# EAGLE design audio-visualizer (EAGLE 9.6.2)
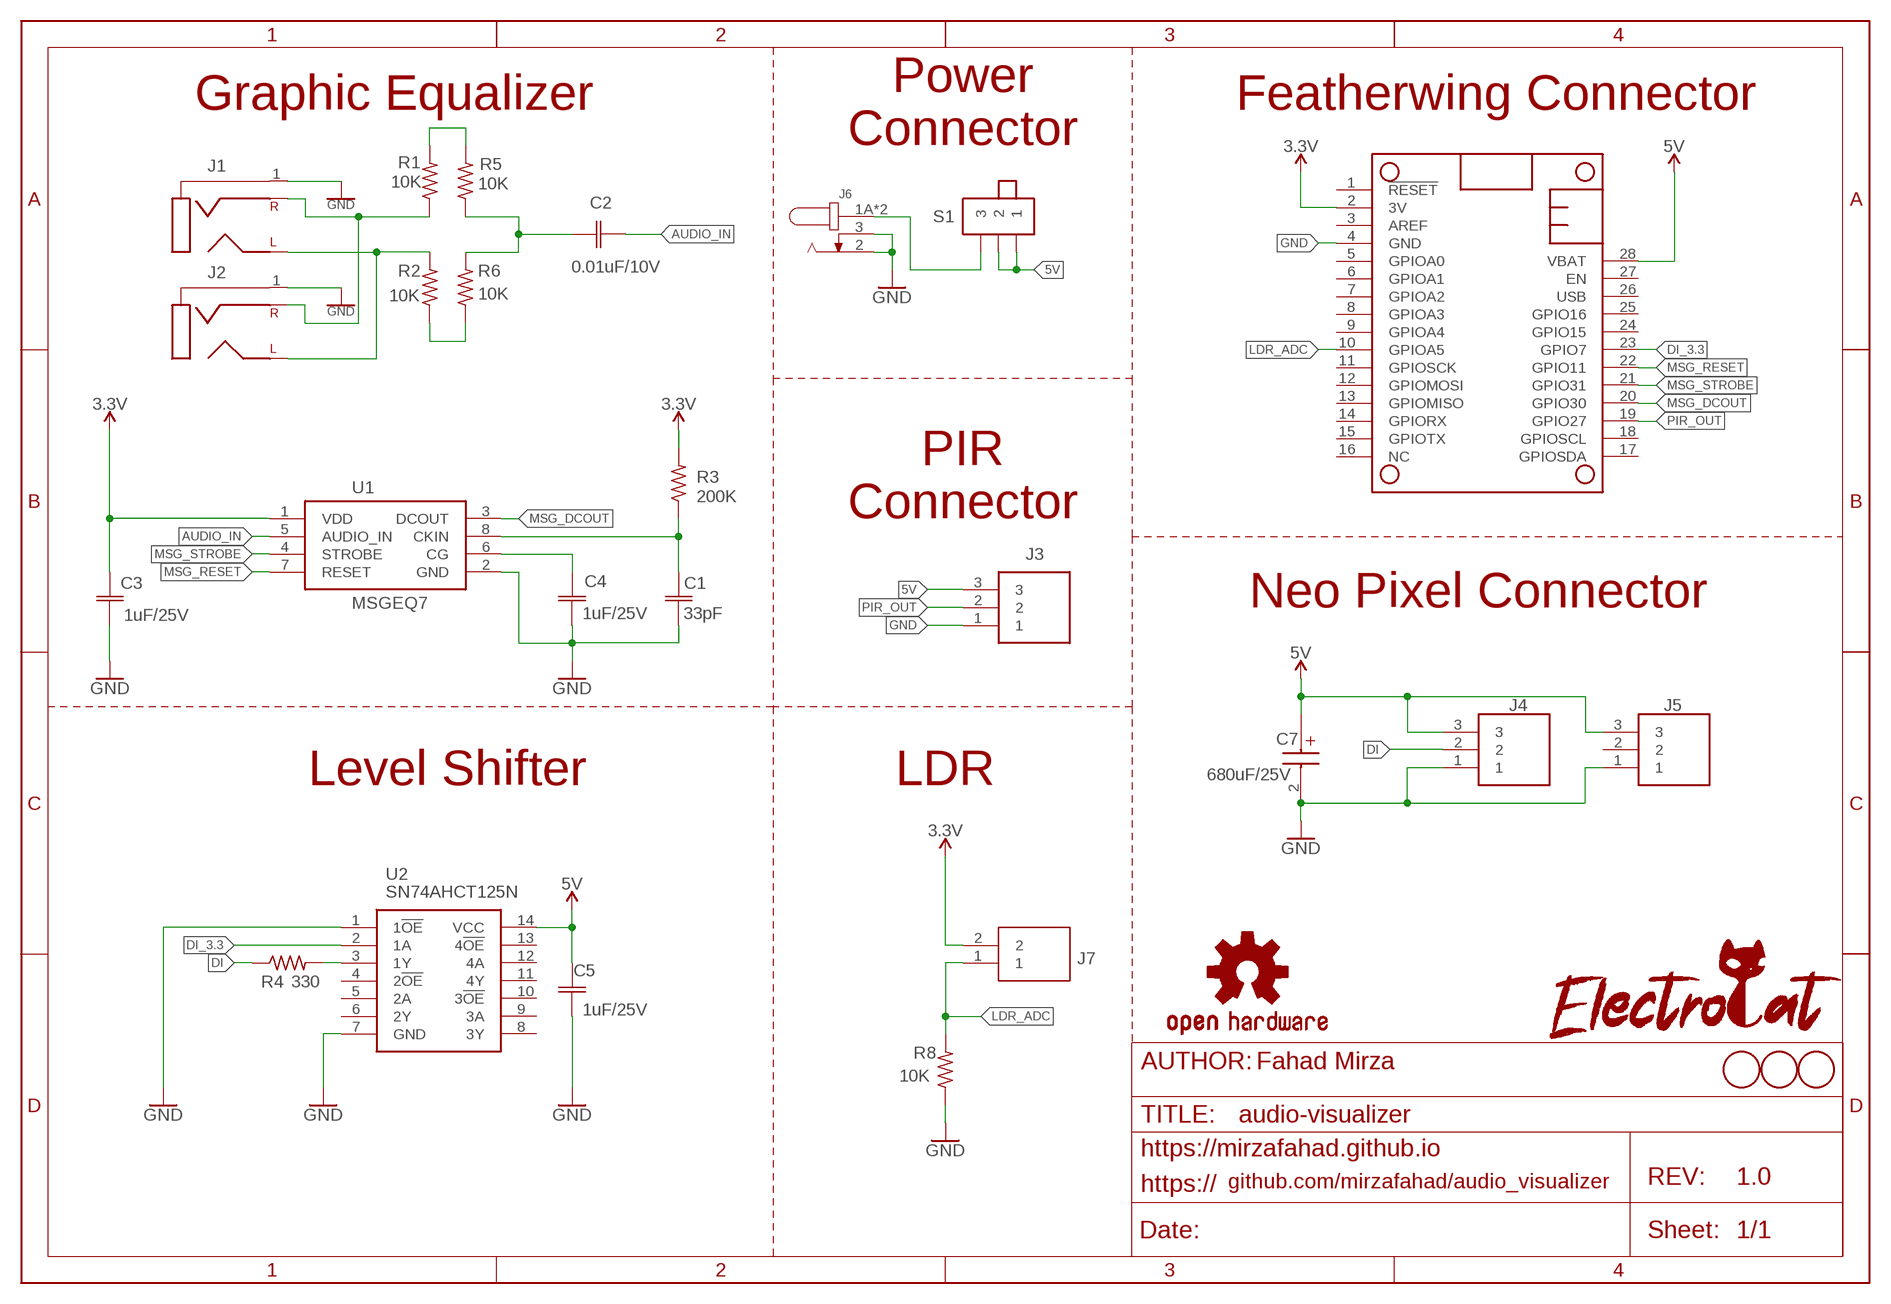
[diagram p0: schematic, sheet 1]
PAGE1 (FRAME_DINA4_L): AUTHOR: Fahad Mirza; URL1: https://; URL2: https://mirzafahad.github.io

## Parts
C1  33pF  CAP_0805  [CAP_CL21_SAM]
C2  0.01uF/10V  CAP_0805  [CAP_CL21_SAM]
C3  1uF/25V  CAP_0805  [CAP_CL21_SAM]
C4  1uF/25V  CAP_0805  [CAP_CL21_SAM]
C5  1uF/25V  CAP_0805  [CAP_CL21_SAM]
C7  680uF/25V  EEE-FK1A681P  [CAPAE830X1050N]
J1  SJ-3523-SMT-TR  [SJ3523SMTTR]
J2  SJ-3523-SMT-TR  [SJ3523SMTTR]
J3  0022057035  [0022057035]
J4  0022057035  [0022057035]
J5  0022057035  [0022057035]
J6  PJ-002AH-SMT-TR  [CUI_PJ-002AH-SMT-TR]
J7  22-05-7025  [MOLEX_22-05-7025]
LOGO1  OSHW-LOGOL-COPPER  [OSHW-LOGO-L_COPPER]
MS1  FEATHERWING_JUST_PINS  [FEATHERWING_JUST_PINS]
R1  10K  R-US_R0805  [R0805]
R2  10K  R-US_R0805  [R0805]
R3  200K  R-US_R0805  [R0805]
R4  330  R-US_R0805  [R0805]
R5  10K  R-US_R0805  [R0805]
R6  10K  R-US_R0805  [R0805]
R8  10K  R-US_R0805  [R0805]
S1  JS102011SAQN  [JS102011SAQN]
U1  MSGEQ7P  MSGEQ7DIL  [DIP08]
U2  SN74AHCT125N  [DIP794W53P254L1930H508Q14N]
U$2  FIDUCIAL  [FIDUCIAL_1MM]
U$3  FIDUCIAL  [FIDUCIAL_1MM]
U$4  FIDUCIAL  [FIDUCIAL_1MM]

## Nets
3.3V: C3.1 J7.2 MS1.2(3V) R3.2 U1.1(VDD)
5V: C5.1 C7.1(+) J3.3 J4.3 J5.3 MS1.28(VBAT) S1.1 S1.2 U2.14(VCC)
AUDIO_IN: C2.2 U1.5(AUDIO_IN)
DI: J4.2 R4.1
DI_3.3: MS1.23(GPIO7) U2.2(1A)
GND: C1.2 C3.2 C4.2 C5.2 C7.2(-) J1.1 J2.1 J3.1 J4.1 J5.1 J6.2 J6.3 MS1.4(GND) R8.1 U1.2(GND) U2.7(GND)
LDR_ADC: J7.1 MS1.10(GPIOA5) R8.2
MSG_DCOUT: MS1.20(GPIO30) U1.3(DCOUT)
MSG_RESET: MS1.22(GPIO11) U1.7(RESET)
MSG_STROBE: MS1.21(GPIO31) U1.4(STROBE)
N$1: R1.2 R5.2
N$2: R2.1 R6.1
N$3: C2.1 R5.1 R6.2
N$4: U2.1(1!OE) ; supply symbol labelled GND
N$5: C1.1 R3.1 U1.8(CKIN)
N$6: C4.1 U1.6(CG)
N$7: J1.2 J2.2 R2.2
N$8: R4.2 U2.3(1Y)
N$9: J1.3 J2.3 R1.1
N$10: J6.1A J6.1B S1.3
PIR_OUT: J3.2 MS1.19(GPIO27)
Unconnected: J5.2 MS1.1(!RESET) MS1.3(AREF) MS1.5(GPIOA0) MS1.6(GPIOA1) MS1.7(GPIOA2) MS1.8(GPIOA3) MS1.9(GPIOA4) MS1.11(GPIOSCK) MS1.12(GPIOMOSI) MS1.13(GPIOMISO) MS1.14(GPIORX) MS1.15(GPIOTX) MS1.16(NC) MS1.17(GPIOSDA) MS1.18(GPIOSCL) MS1.24(GPIO15) MS1.25(GPIO16) MS1.26(USB) MS1.27(EN) U2.4(2!OE) U2.5(2A) U2.6(2Y) U2.8(3Y) U2.9(3A) U2.10(3!OE) U2.11(4Y) U2.12(4A) U2.13(4!OE)

## Notes on the sheet
- Graphic Equalizer | Featherwing Connector
- Power
  Connector
- PIR
  Connector
- Neo Pixel Connector
- Level Shifter | LDR
- github.com/mirzafahad/audio_visualizer | 1.0

## Library data of the parts
C1-C5 = SamacSys_Parts:CAP_0805; BUILT_BY: EMA_Rocco; COPYRIGHT: Copyright (C) 2018 Accelerated Designs. All rights reserved; MANUFACTURER_PART_NUMBER: CL21B105KPFNNNE; SOURCELIBRARY: Samsung_2019-08-29; VENDOR: Samsung
C7 = SamacSys_Parts:EEE-FK1A681P: Cap Aluminum Lytic 680uF 10V 20% (8 X 10.2mm) SMD 600mA 2000h 105C Automotive T/R Source: Datasheet <https://www.arrow.com/en/products/eee-fk1a681p/panasonic>; ARROW_PART_NUMBER: EEE-FK1A681P; ARROW_PRICE-STOCK: https://www.arrow.com/en/products/eee-fk1a681p/panasonic; DESCRIPTION: Cap Aluminum Lytic 680uF 10V 20% (8 X 10.2mm) SMD 600mA 2000h 105C Automotive T/R; HEIGHT: 10.5mm; MANUFACTURER_NAME: Panasonic; MANUFACTURER_PART_NUMBER: EEE-FK1A681P; MOUSER_PART_NUMBER: 667-EEE-FK1A681P; MOUSER_PRICE-STOCK: https://www.mouser.co.uk/ProductDetail/Panasonic/EEE-FK1A681P?qs=qE6bgDGEOCt2lMkYs3ptmA%3D%3D
J1 J2 = SamacSys_Parts:SJ-3523-SMT-TR: Phone Connectors Audio Jacks Source: Datasheet <http://www.cui.com/product/resource/sj-352x-smt-series.pdf>; ARROW_PART_NUMBER: SJ-3523-SMT-TR; ARROW_PRICE-STOCK: https://www.arrow.com/en/products/sj-3523-smt-tr/cui-devices; DESCRIPTION: Phone Connectors Audio Jacks; HEIGHT: mm; MANUFACTURER_NAME: CUI Devices; MANUFACTURER_PART_NUMBER: SJ-3523-SMT-TR; MOUSER_PART_NUMBER: 490-SJ-3523-SMT-TR; MOUSER_PRICE-STOCK: https://www.mouser.co.uk/ProductDetail/CUI-Devices/SJ-3523-SMT-TR?qs=WyjlAZoYn51zOHzJ3r4ZRA%3D%3D
J3-J5 = SamacSys_Parts:0022057035: Headers & Wire Housings SPOX .098" HDR 03P RA SN Source: Datasheet <https://componentsearchengine.com/Datasheets/1/0022057035.pdf>; ARROW_PART_NUMBER: 0022057035; ARROW_PRICE-STOCK: https://www.arrow.com/en/products/0022057035/molex; DESCRIPTION: Headers & Wire Housings SPOX .098" HDR 03P RA SN; HEIGHT: 4.9mm; MANUFACTURER_NAME: Molex; MANUFACTURER_PART_NUMBER: 0022057035; MOUSER_PART_NUMBER: N/A; MOUSER_PRICE-STOCK: https://www.mouser.co.uk/ProductDetail/Molex/0022057035?qs=PBcRNPEHKsoVys%2F0GjmYOQ%3D%3D
J6 = PersonalCollection:PJ-002AH-SMT-TR: 2.0 mm Center Pin, 5.0 A, Right Angle, Surface Mount (SMT), Dc Power Jack Connector Check prices <https://snapeda.com/parts/PJ-002AH-SMT-TR/CUI%20Devices/view-part/?ref=eda>; AVAILABILITY: Good; CUI_PURCHASE_URL: https://www.cuidevices.com/product/interconnect/connectors/dc-power-connectors/jacks/pj-002ah-smt-tr?utm_source=snapeda.com&utm_medium=referral&utm_campaign=snapedaBOM; DESCRIPTION: 2.0 x 6.5 mm, 5.0 A, Horizontal, Surface Mount (SMT), Dc Power Jack Connector; DIGIKEY-PURCHASE-URL: https://snapeda.com/shop?store=DigiKey&id=1213928; MF: CUI Devices; MOUSER-PURCHASE-URL: https://snapeda.com/shop?store=Mouser&id=1213928; MP: PJ-002AH-SMT-TR; PACKAGE: None; PRICE: None
J7 = 22-05-7025:22-05-7025: Connector Header Through Hole, Right Angle 2 position 0.098in (2.50mm) Buy Part <https://snapeda.com/parts/22-05-7025/Molex/view-part/?ref=eda>; AVAILABILITY: Warning; DESCRIPTION: Connector Header Through Hole, Right Angle 2 position 0.098 (2.50mm); MF: Molex; MOUSER-PURCHASE-URL: https://snapeda.com/shop?store=Mouser&id=44437; MP: 22-05-7025; PACKAGE: None; PRICE: None
LOGO1 = SparkFun-Aesthetics:OSHW-LOGO: Open-Source Hardware (OSHW) Logo This logo indicates the piece of hardware it is found on incorporates a OSHW license and/or adheres to the definition of open source hardware found here: http://freedomdefined.org/OSHW
MS1 = adafruit:FEATHERWING
R1 R2 R4-R6 R8 = SamacSys_Parts:R-US_: RESISTOR, American symbol
R3 = PersonalCollection:R-US_: RESISTOR, American symbol
S1 = JS102011SAQN:JS102011SAQN: C & K COMPONENTS - JS102011SAQN - SWITCH, SPDT, 0.6A, 6VDC, SIDE, SMD Source: Datasheet <http://www.ckswitches.com/media/1422/js.pdf>; ARROW_PART_NUMBER: JS102011SAQN; ARROW_PRICE-STOCK: https://www.arrow.com/en/products/js102011saqn/ck; DESCRIPTION: C & K COMPONENTS - JS102011SAQN - SWITCH, SPDT, 0.6A, 6VDC, SIDE, SMD; HEIGHT: mm; MANUFACTURER_NAME: C & K COMPONENTS; MANUFACTURER_PART_NUMBER: JS102011SAQN; MOUSER_PART_NUMBER: 611-JS102011SAQN; MOUSER_PRICE-STOCK: https://www.mouser.co.uk/ProductDetail/CK/JS102011SAQN?qs=LgMIjt8LuD%252B69bNM9a%2FozQ%3D%3D
U1 = SamacSys_Parts:MSGEQ7: 7-band graphic equalizer This IC is for making a 7 band/channel audio spectrometer. There are two versions of this part. The DIP available on the storefront, and the SO used in product. Datasheet <https://www.sparkfun.com/datasheets/Components/General/MSGEQ7.pdf> SparkFun Products Storefront component: Graphic Equalizer Display Filter - MSGEQ7 <https://www.sparkfun.com/products/10468> (COM-10468) SparkFun Spectrum Shield <https://www.sparkfun.com/products/13116> (DEV-13116); PROD_ID: IC-12196
U2 = SamacSys_Parts:SN74AHCT125N: Quadruple Bus Buffer Gates With 3-State Outputs Source: Datasheet <http://www.ti.com/lit/gpn/sn74ahct125>; DESCRIPTION: Quadruple Bus Buffer Gates With 3-State Outputs; HEIGHT: 5.08mm; MANUFACTURER_NAME: Texas Instruments; MANUFACTURER_PART_NUMBER: SN74AHCT125N; MOUSER_PART_NUMBER: 595-SN74AHCT125N; MOUSER_PRICE-STOCK: https://www.mouser.com/Search/Refine.aspx?Keyword=595-SN74AHCT125N
U$2-U$4 = adafruit:FIDUCIAL: For use by pick and place machines to calibrate the vision/machine, 1mm By microbuilder.eu

## Board
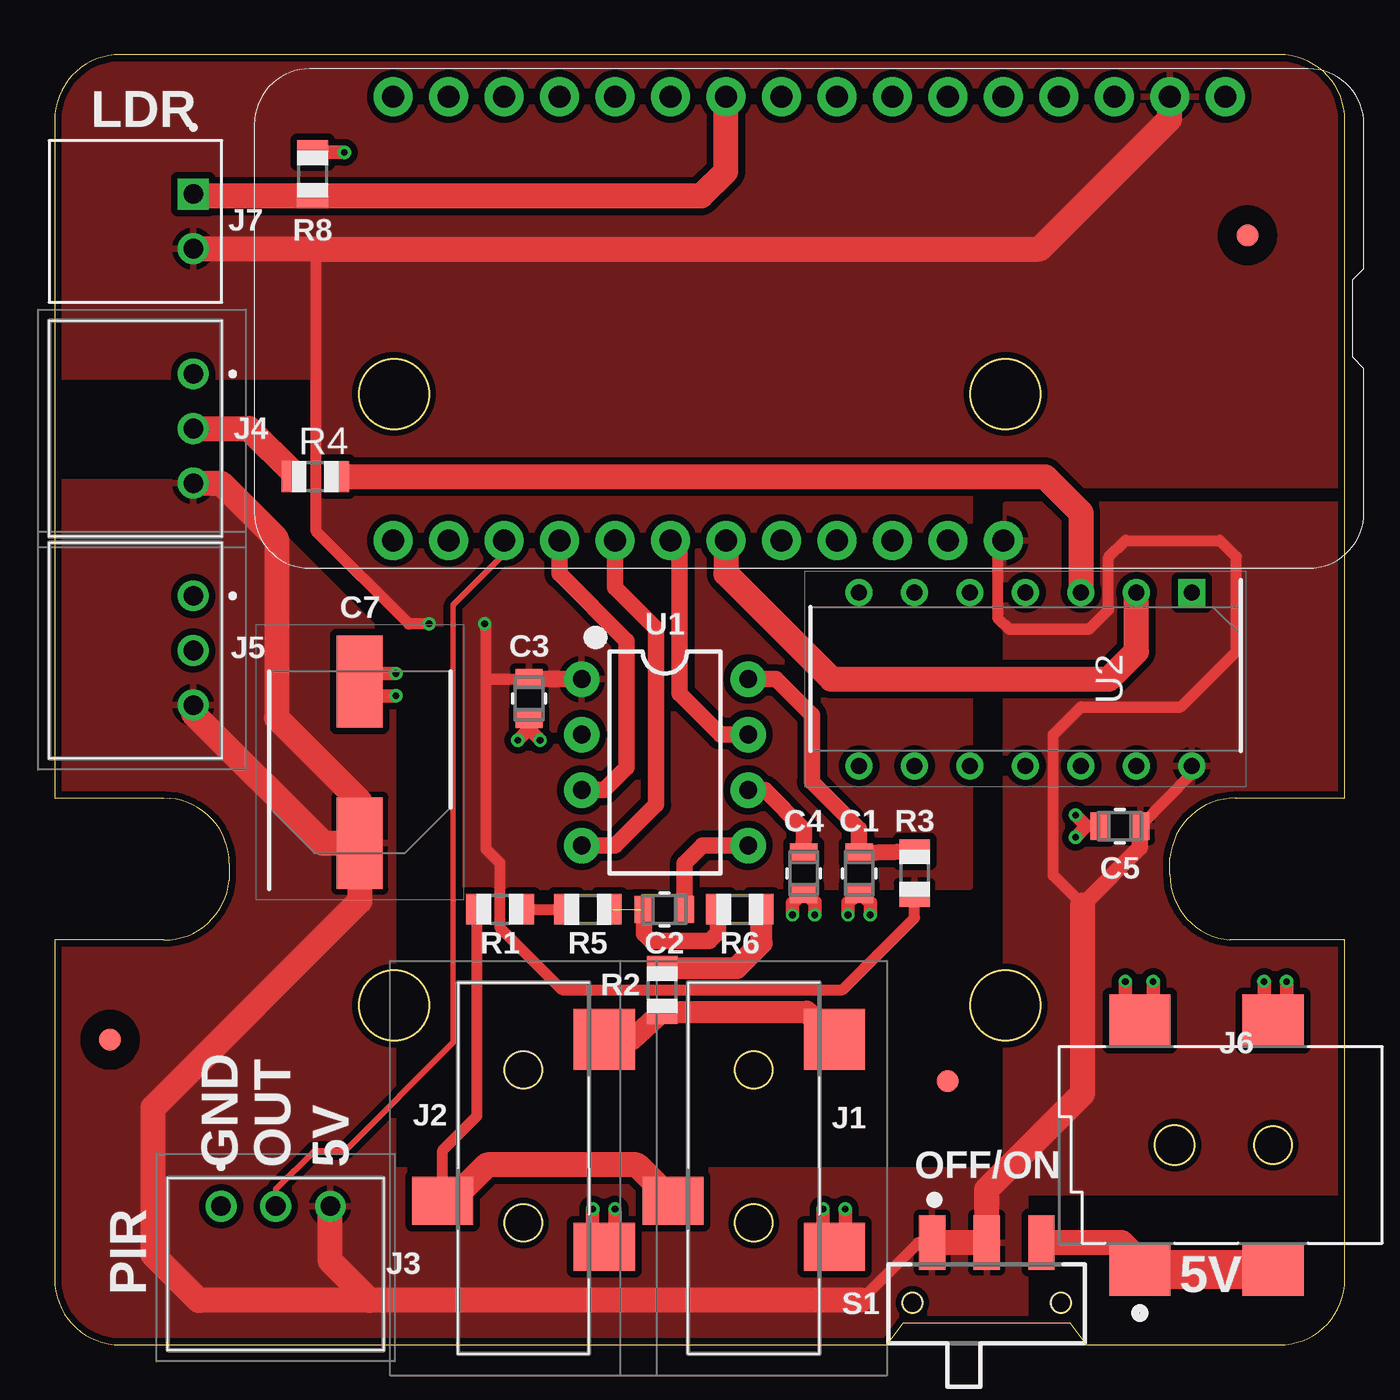
[diagram p1: board, top side]
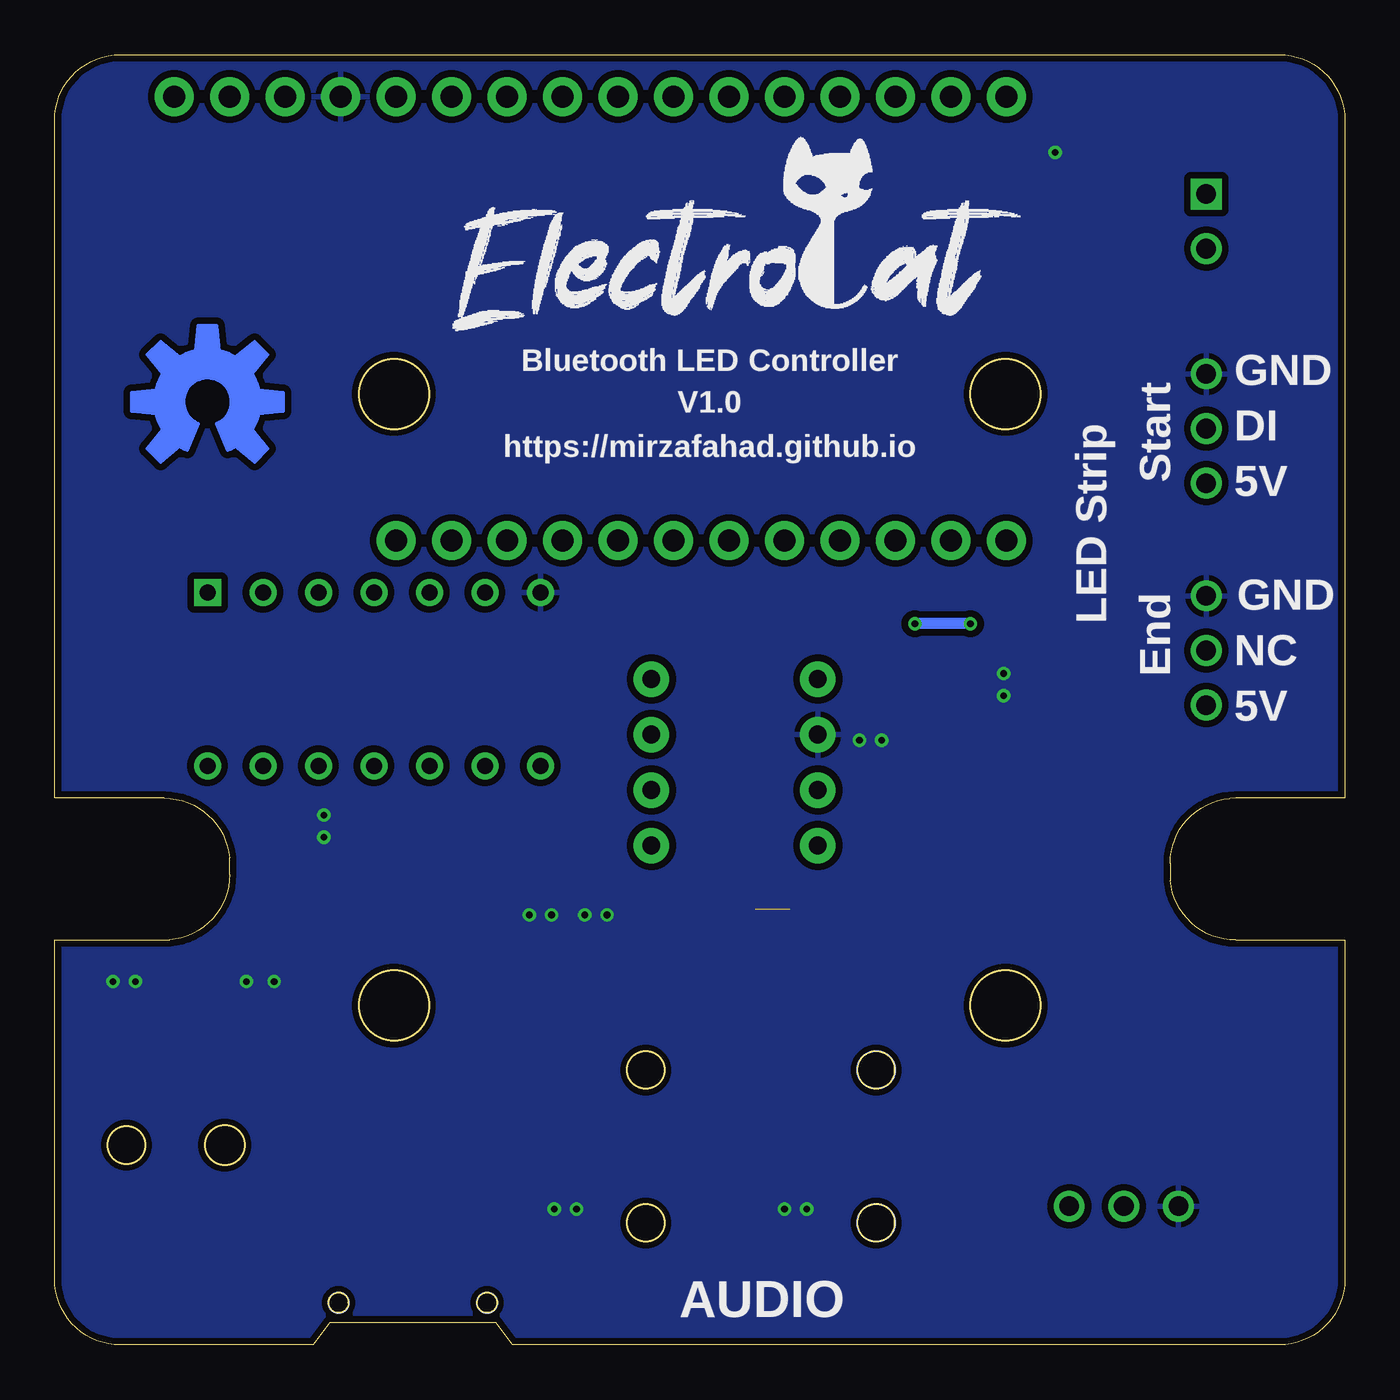
[diagram p2: board, bottom side, seen from below]

Size 59.07 x 59.07 mm. Coordinates in mm from the lower left corner, seen from the top.
Outline: 45.62,1.9 arc173 46.52,1.9 46.52,1.96 arc173 45.62,1.96 45.62,1.9
Outline: 38.82,1.9 arc173 39.72,1.9 39.72,1.96 arc173 38.82,1.96 38.82,1.9
Outline: 21.35,6.43 21.43,6.44 21.5,6.44 21.57,6.43 21.65,6.42 21.72,6.4 21.79,6.37 21.86,6.34 21.92,6.31 21.98,6.26 22.04,6.21 22.09,6.16 22.14,6.11 22.18,6.04 22.22,5.98 22.25,5.91 22.27,5.84 22.29,5.77 22.31,5.7 22.31,5.62 22.31,5.55 22.31,5.48 22.29,5.4 22.27,5.33 22.25,5.26 22.22,5.2 22.18,5.13 22.14,5.07 22.09,5.01 22.04,4.96 21.98,4.91 21.92,4.87 21.86,4.83 21.79,4.8 21.72,4.78 21.65,4.76 21.57,4.75 21.5,4.74 21.43,4.74 21.35,4.75 21.28,4.76 21.21,4.78 21.14,4.8 21.07,4.83 21.01,4.87 20.95,4.91 20.89,4.96 20.84,5.01 20.79,5.07 20.75,5.13 20.71,5.2 20.68,5.26 20.65,5.33 20.63,5.4 20.62,5.48 20.61,5.55 20.61,5.62 20.62,5.7 20.63,5.77 20.65,5.84 20.68,5.91 20.71,5.98 20.75,6.04 20.79,6.11 20.84,6.16 20.89,6.21 20.95,6.26 21.01,6.31 21.07,6.34 21.14,6.37 21.21,6.4 21.28,6.42 21.35,6.43
Outline: 21.35,13.43 21.43,13.44 21.5,13.44 21.57,13.43 21.65,13.42 21.72,13.4 21.79,13.37 21.86,13.34 21.92,13.31 21.98,13.26 22.04,13.21 22.09,13.16 22.14,13.11 22.18,13.04 22.22,12.98 22.25,12.91 22.27,12.84 22.29,12.77 22.31,12.7 22.31,12.62 22.31,12.55 22.31,12.48 22.29,12.4 22.27,12.33 22.25,12.26 22.22,12.2 22.18,12.13 22.14,12.07 22.09,12.01 22.04,11.96 21.98,11.91 21.92,11.87 21.86,11.83 21.79,11.8 21.72,11.78 21.65,11.76 21.57,11.74 21.5,11.74 21.43,11.74 21.35,11.74 21.28,11.76 21.21,11.78 21.14,11.8 21.07,11.83 21.01,11.87 20.95,11.91 20.89,11.96 20.84,12.01 20.79,12.07 20.75,12.13 20.71,12.2 20.68,12.26 20.65,12.33 20.63,12.4 20.62,12.48 20.61,12.55 20.61,12.62 20.62,12.7 20.63,12.77 20.65,12.84 20.68,12.91 20.71,12.98 20.75,13.04 20.79,13.11 20.84,13.16 20.89,13.21 20.95,13.26 21.01,13.31 21.07,13.34 21.14,13.37 21.21,13.4 21.28,13.42 21.35,13.43
Outline: 54.05,25.03 59.07,25.03 59.07,56.07 59.06,56.33 arc85 56.07,59.07 3,59.07 2.74,59.06 arc85 0,56.07 0,25.03 5,25.03 5.26,25.02 arc-85 8,22.03 8,21.53 7.99,21.27 arc-85 5,18.53 0,18.53 0,3 arc90 3,0 38.1,0 38.86,1.02 46.48,1.02 47.24,0 56.07,0 56.33,0.01 arc85 59.07,3 59.07,18.53 54.05,18.53 53.79,18.54 arc-85 51.05,21.53 51.05,22.03 51.07,22.29 arc-85 54.05,25.03
Outline: circle at 51.28,9.15 radius 0.9
Outline: circle at 55.78,9.15 radius 0.85
Outline: circle at 32,5.59 radius 0.85
Outline: circle at 32,12.59 radius 0.85
Outline: circle at 15.54,15.54 radius 1.6
Outline: circle at 43.53,43.53 radius 1.6
Outline: circle at 15.54,43.53 radius 1.6
Outline: circle at 43.53,15.54 radius 1.6
Copper layers (1*16): Top 0.035mm / dielectric 1.5mm / Bottom 0.035mm
Design rules "SeeedStudio_2layer_DRU_no_angle_20140221": minimum track width 6mil, minimum drill 12mil, track to track 6mil, track to pad 6mil, pad to pad 6mil, via to via 6mil, smd to smd 0mil, copper to edge 10mil, drill to drill 10mil, minimum pad ring 10mil, minimum via ring 6mil, stop-mask expansion 2mil, vias tented up to drill 100mil, thermal gap 10mil

### Footprints (pad centres in the part's own frame; a part is rotated, then mirrored left to right if it is on the bottom)
CAP_CL21_SAM = smd 0.856 x 1.25: 1 -0.928,0; 2 0.928,0
CAPAE830X1050N = smd 4.2 x 2.1: 1 -3.7,0; 2 3.7,0
SJ3523SMTTR = smd 2.2 x 2.8: 1 -1.1,-3.7; 3 1,3.7 | smd 2.8 x 2.8: 2 8.4,-3.7 | hole 1.7: 7,0; 0,0
0022057035 = drill 0.9 pad 1.4: 1 0,0; 2 -2.5,0; 3 -5,0
CUI_PJ-002AH-SMT-TR = smd 2.8 x 2.4: 1A 0,0; 1B -6.1,0; 2 -6.1,-11.4; 3 0,-11.4 | hole 1.7: -6.1,-5.7 | hole 1.8: -1.6,-5.7
MOLEX_22-05-7025 = drill 0.9 square: 1 -1.25,0 | drill 0.9: 2 1.25,0
FEATHERWING_JUST_PINS = drill 1 pad 1.778: 1 6.35,1.27; 2 8.89,1.27; 3 11.43,1.27; 4 13.97,1.27; 5 16.51,1.27; 6 19.05,1.27; 7 21.59,1.27; 8 24.13,1.27; 9 26.67,1.27; 10 29.21,1.27; 11 31.75,1.27; 12 34.29,1.27; 13 36.83,1.27; 14 39.37,1.27; 15 41.91,1.27; 16 44.45,1.27; 17 44.45,21.59; 18 41.91,21.59; 19 39.37,21.59; 20 36.83,21.59; 21 34.29,21.59; 22 31.75,21.59; 23 29.21,21.59; 24 26.67,21.59; 25 24.13,21.59; 26 21.59,21.59; 27 19.05,21.59; 28 16.51,21.59
R0805 = smd 1.1 x 1.4: 1 -1,0; 2 1,0
JS102011SAQN = smd 1.2 x 2.5: 1 -2.5,1; 2 0,1; 3 2.5,1 | hole 0.9: -3.4,-1.75; 3.4,-1.75
DIP08 = drill 0.813 pad 1.626: 1 -3.81,-3.81; 2 -1.27,-3.81; 3 1.27,-3.81; 4 3.81,-3.81; 5 3.81,3.81; 6 1.27,3.81; 7 -1.27,3.81; 8 -3.81,3.81
DIP794W53P254L1930H508Q14N = drill 0.73 pad 1.13 square: 1 -3.97,7.62 | drill 0.73 pad 1.13: 2 -3.97,5.08; 3 -3.97,2.54; 4 -3.97,0; 5 -3.97,-2.54; 6 -3.97,-5.08; 7 -3.97,-7.62; 8 3.97,-7.62; 9 3.97,-5.08; 10 3.97,-2.54; 11 3.97,0; 12 3.97,2.54; 13 3.97,5.08; 14 3.97,7.62
FIDUCIAL_1MM = smd 1 x 1: 1 0,0

### Placement (x,y rotation side)
C1  36.83,21.59 270 top
C2  27.91,19.94 0 top
C3  21.72,29.59 270 top
C4  34.29,21.59 270 top
C5  48.77,23.75 180 top
C7  13.97,26.67 90 top
J1  32,5.59 90 top
J2  21.46,5.59 90 top
J3  7.62,6.35 180 top
J4  6.35,44.45 90 top
J5  6.35,34.29 90 top
J6  49.68,3.45 180 top
J7  6.35,51.44 270 top
LOGO1  52.07,43.18 0 bottom
MS1  59.94,58.42 180 top
R1  20.4,19.94 0 top
R2  27.81,16.26 270 top
R3  39.37,21.59 270 top
R4  11.94,39.75 0 top
R5  24.41,19.94 180 top
R6  31.37,19.94 180 top
R8  11.81,53.59 270 top
S1  42.67,3.68 0 top
U1  27.94,26.67 270 top
U2  44.45,30.48 270 top
U$2  40.89,12.06 0 top
U$3  54.61,50.8 0 top
U$4  2.54,13.97 0 top

### Tracks (layer width: path | path; a pad name or v marks a point on that pad's centre or on a via)
3.3V  (via drill 0.3)
  Top 0.508: C3.1 21.73,30.48 19.81,30.48 19.74,30.56 | 11.96,50.16 11.96,37.27 16.23,32.99 17.12,32.99 v17.14,33.02 | 19.74,30.56 19.74,32.97 v19.68,33.02 | 19.74,30.56 19.74,22.72 20.38,22.08 20.38,19.12 23.24,16.26 36.07,16.26 39.37,19.56 R3.2 | J7.2 6.37,50.16
  Top 0.762: C3.1 21.76,30.48 U1.1
  Top 1.143: MS1.2 51.05,56.13 45.09,50.16 11.96,50.16 6.37,50.16
  Bottom 0.508: v17.14,33.02 v19.68,33.02
  pour Top (isolate 0.305): 0,44.32 11.94,44.32 11.94,37.34 16.26,33.02 18.29,33.02 18.29,21.34 18.41,21.21 18.67,20.95 41.91,20.95 41.91,39.37 59.05,39.37 59.05,58.93 52.58,58.93 0,58.93
5V
  Top 0.508: 14.43,2.03 14.41,2.04 | MS1.28 43.43,36.79 43.17,36.53 43.17,33.28 43.69,32.77 47.37,32.77 48.25,33.65 48.25,36.06 49.02,36.83 53.34,36.83 54.1,36.07 54.1,31.75 51.56,29.21 46.99,29.21 45.72,27.94 45.72,21.49 47.06,20.14 | S1.1 39.54,4.68 36.9,2.04 | C5.1 52.07,26.15 U2.14
  Top 0.762: J5.3 6.35,28.91 | C5.1 49.69,22.77 47.06,20.14
  Top 1.143: 6.35,28.91 12.29,22.97 C7.1 | J4.3 7.62,39.45 10.16,36.91 10.16,28.7 13.97,24.89 C7.1 | 47.06,20.14 47.06,11.51 42.67,7.11 S1.2 S1.1 | 36.9,2.04 14.41,2.04 12.62,3.84 J3.3 | 14.43,2.03 6.6,2.03 4.51,4.13 4.51,10.86 13.97,20.32 C7.1
  pour Top (isolate 0.305): 0,39.5 8,39.5 10.41,37.08 15.49,32 15.49,8 44.45,8 44.45,1.14 39.12,1.14 38.1,0.13 2.03,0.13 1.4,0.13 1.14,0.38 0,1.52 0,2.79 0,18.41 0.13,18.54 5.71,18.54 7.75,20.57 7.75,20.83 7.75,23.37 7.62,23.5 6.1,25.02 5.59,25.02 0.13,25.02 0,25.15
  pour Top (isolate 0.305): 43.56,38.48 43.56,6.99 59.05,6.99 59.05,18.8 52.58,18.8 52.58,25.15 58.93,25.15 58.93,38.48
AUDIO_IN
  Top 0.762: U1.5 29.67,22.86 28.84,22.04 C2.2
DI
  Top 0.508: 10.94,39.9 R4.1
  Top 1.143: J4.2 8.89,41.95 10.94,39.9
DI_3.3
  Top 1.143: MS1.23 30.73,35.31 35.56,30.48 48.26,30.48 49.53,31.75 U2.2
GND  (via drill 0.3)
  Top 0.508: 36.2,4.95 36.39,4.76 36.11,4.49 J1.1 35.39,4.49 35.18,4.7 | 24.64,4.7 24.85,4.49 J2.1 25.16,4.84 25.34,5.02 25.65,4.7 | 55.37,14.52 J6.2 56.41,14.2 | 50.29,14.21 J6.3 49.32,14.48 49.02,14.48 | 13.97,30.73 C7.2 13.97,29.72 | C5.2 47.24,23.75
  Top 0.61: v36.2,6.22 36.2,4.95 | 24.64,4.7 v24.64,6.22 | v33.78,19.68 33.78,20.23 C4.2 34.8,20.28 v34.8,19.68 | v36.32,19.68 36.32,20.26 C1.2 37.34,20.26 v37.34,19.68 | v55.37,16.64 55.37,14.52 | v50.29,16.64 50.29,14.21 | v49.02,16.64 49.02,14.48 | v56.41,16.64 56.41,14.2 | 13.97,30.73 v15.62,30.73 | v15.62,29.72 13.97,29.72 | 35.18,4.7 v35.18,6.22 | v25.65,6.22 25.65,4.7 | v46.74,24.26 47.24,23.75 v46.74,23.24 | R8.1 13.25,54.59 v13.26,54.59 | 21.72,28.19 v21.21,27.69 | C3.2 21.72,28.19 | 21.72,28.19 v22.23,27.69
  pour Bottom (isolate 0.305): 0,25.02 0,55.91 arc-45 0.88,58.03 1.27,58.42 arc-45 2.8,59.05 56.03,59.05 arc-45 58.16,58.18 58.67,57.66 arc-45 59.05,56.74 59.05,25.02 54.2,25.02 arc45 52.08,24.14 51.77,23.83 arc45 51.05,22.1 51.05,21.56 arc45 51.93,19.44 52.2,19.18 arc45 53.73,18.54 59.05,18.54 59.05,3.02 arc-45 58.18,0.9 57.78,0.51 arc-45 56.56,0 3.66,0 arc-45 1.53,0.88 0.88,1.53 arc-45 0,3.66 0,18.54 4.98,18.54 arc45 7.1,19.42 7.62,19.94 arc45 8,20.86 8,21.87 arc45 7.12,23.99 6.6,24.51 arc45 5.38,25.02
LDR_ADC
  Top 0.508: 11.92,52.59 R8.2
  Top 0.762: 6.44,52.59 J7.1
  Top 1.143: MS1.10 30.73,53.72 29.6,52.59 11.92,52.59 | R8.2 6.44,52.59
MSG_DCOUT
  Top 0.762: U1.3 25.15,25.4 26.19,26.44 26.19,32.23 23.11,35.31 MS1.20
MSG_RESET
  Top 0.762: U1.7 30.48,27.94 28.6,29.82 28.6,36.42 MS1.22
MSG_STROBE
  Top 0.762: U1.4 25.65,22.86 27.53,24.74 27.53,32.79 25.65,34.67 MS1.21
N$1
  Top 0.508: R1.2 R5.2
N$2
  Top 1.016: R2.1 31.23,17.26 32.37,18.4 R6.1
N$3  (1 unrouted)
  Top 0.762: C2.1 26.99,18.81 27.3,18.49 29.97,18.49 30.37,18.89 R6.2
N$5
  Top 0.762: U1.8 33.02,30.48 34.67,28.83 34.67,25.78 36.83,23.62 C1.1 R3.1
N$6
  Top 0.762: C4.1 34.31,23.6 32.51,25.4 U1.6
N$7
  Top 0.508: J2.2 26.45,13.99
  Top 1.016: 26.45,13.99 R2.2 34.44,15.26 J1.2
N$8
  Top 1.143: R4.2 45.34,39.75 46.99,38.1 U2.3
N$9
  Top 0.508: R1.1 19.32,19.84 19.32,10.46 17.76,8.91 J2.3 18.14,6.59
  Top 1.143: 18.14,6.59 19.8,8.24 26.65,8.24 J1.3
N$10
  Top 0.508: J6.1A 49.87,3.67
  Top 1.143: 49.87,3.67 48.85,4.68 S1.3
  Top 1.778: J6.1A J6.1B
PIR_OUT
  Top 0.254: J3.2 10.12,7.11 11.9,8.89 13.29,8.89 18.25,13.84 18.25,33.87 20.57,36.2 MS1.19

### Text on the board
tPlace: LDR | GND | OUT | 5V | OFF/ON | PIR | 5V
bPlace: Bluetooth LED Controller | GND | V1.0 | DI | https://mirzafahad.github.io | 5V | Start | GND | LED Strip | NC | End | 5V | AUDIO
tNames: J6